# EAGLE design EL_Inverter1 (EAGLE 7.2.0)
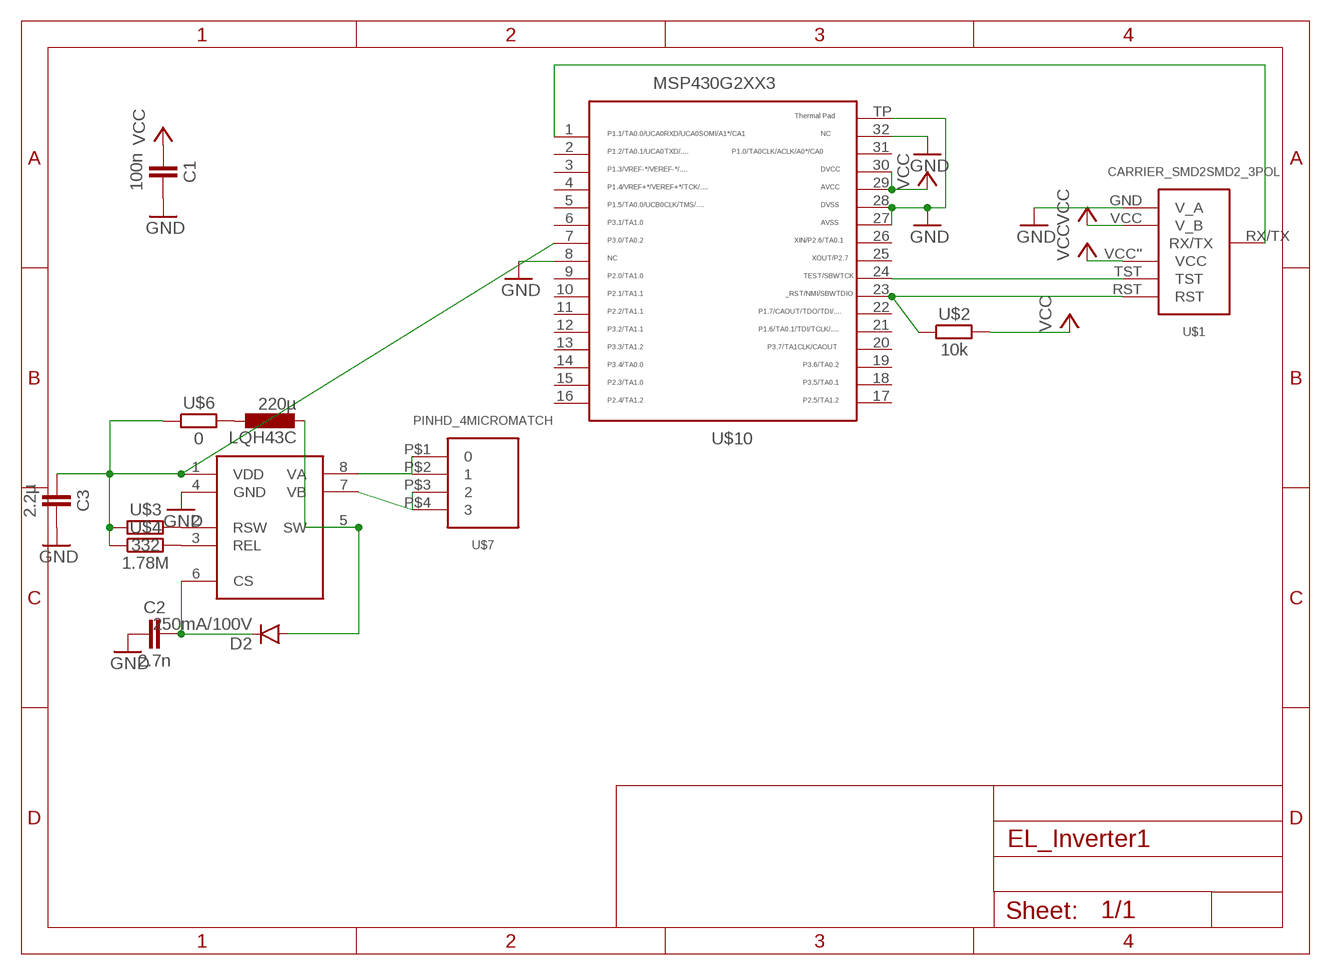
[diagram p0: schematic, sheet 1]

## Parts
C1  100n  CAPACITOR  [603]
C2  2.7n  CAPACITOR  [603]
C3  2.2µ  CAPACITOR  [603]
D2  250mA/100V  DIODEBAS16  [SOD-323]
LQH43C  220µ  L-EUL1812  [L1812]
U$1  CARRIER_SMD2SMD2_3POL  [CARRIER_SMD2_3POL]
U$2  10k  RESISTOR0603  [603]
U$3  332  RESISTOR0603  [603]
U$4  1.78M  RESISTOR0603  [603]
U$6  0  RESISTOR0603  [603]
U$7  PINHD_4MICROMATCH  [MICROMATCH4P0L]
U$8  MIC4830  [MSOP8]
U$10  MSP430G2553  [QFN32]

## Nets
GND: C1.2 C2.1 C3.2 U$1.GND(V_A) U$8.4(GND) U$10.8 U$10.27 U$10.28 U$10.32 U$10.TP
N$2: U$3.2 U$8.2(RSW)
N$3: U$1.TST U$10.24
N$4: U$1.RST U$2.1 U$10.23
N$5: U$4.2 U$8.3(REL)
N$6: C2.2 D2.C U$8.6(CS)
N$7: D2.A LQH43C.2 U$8.5(SW)
N$11: LQH43C.1 U$6.2
N$12: U$1.RX/TX U$10.1
N$13: C3.1 U$3.1 U$4.1 U$6.1 U$8.1(VDD) U$10.7
N$14: U$7.P$1 U$7.P$2 U$8.8(VA)
N$16: U$7.P$3 U$7.P$4 U$8.7(VB)
VCC: C1.1 U$1.VCC''(VCC) U$1.VCC(V_B) U$2.2 U$10.29 U$10.30
Unconnected: U$10.2 U$10.3 U$10.4 U$10.5 U$10.6 U$10.9 U$10.10 U$10.11 U$10.12 U$10.13 U$10.14 U$10.15 U$10.16 U$10.17 U$10.18 U$10.19 U$10.20 U$10.21 U$10.22 U$10.25 U$10.26 U$10.31

## Library data of the parts
C1-C3 = thar:CAPACITOR
D2 = SparkFun-DiscreteSemi:DIODE: Diode These are standard reverse protection diodes and small signal diodes. SMA package can handle up to about 1A. SOD-323 can handle about 200mA. What the SOD-323 package when ordering, there are some mfgs out there that are 5-pin packages.; PROD_ID: DIO-09646
LQH43C = rcl:L-EU: INDUCTOR, European symbol
U$1 = thar:CARRIER_SMD2
U$2-U$4 U$6 = thar:RESISTOR
U$7 = thar:PINHD_4
U$8 = thar:MIC4830: MICREL SEMICONDUCTOR - MIC4830YMM - EL TREIBER,LN, 180VP-P, 8MSOP Farnell Best.Nr.: 1663113 Herst.Bez.: MIC4830YMM
U$10 = thar:MSP430G2553: TEXAS INSTRUMENTS MSP430G2553IRHB32R MCU, 16BIT, MSP430, 16MHZ, QFN-32 Farnell Best.Nr.: 2325726 Herst.Bez.: MSP430G2553IRHB32R

## Board
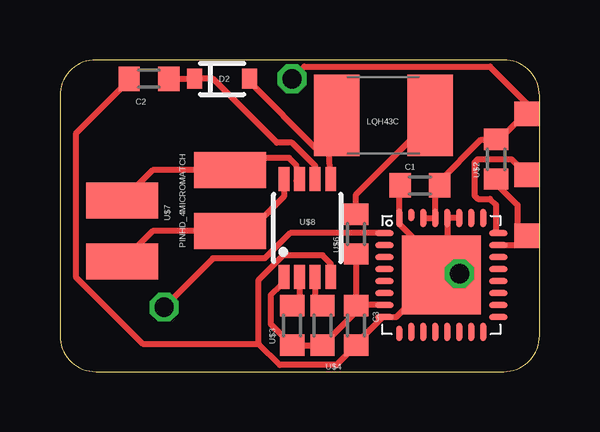
[diagram p1: board, top side]
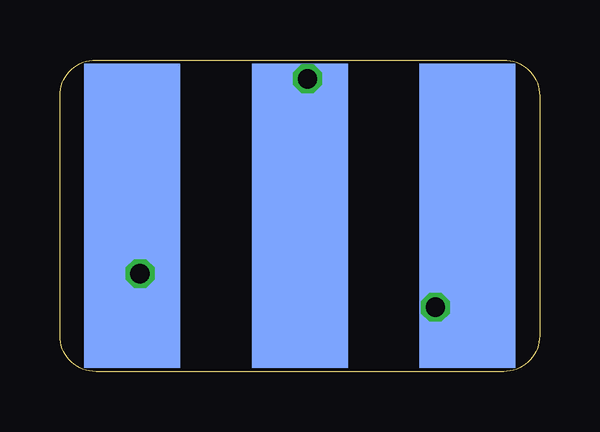
[diagram p2: board, bottom side, seen from below]

Size 20 x 13 mm. Coordinates in mm from the lower left corner, seen from the top.
Copper layers (1*16): Top 0.035mm / dielectric 1.5mm / Bottom 0.035mm
Design rules "Bilex DRU *": minimum track width 10mil, minimum drill 24mil, track to track 10mil, track to pad 10mil, pad to pad 10mil, via to via 10mil, smd to smd 10mil, copper to edge 1mil, drill to drill 8mil, minimum pad ring 10mil, minimum via ring 8mil, stop-mask expansion 4mil, vias tented up to drill 0mil, thermal gap 10mil

### Footprints (pad centres in the part's own frame; a part is rotated, then mirrored left to right if it is on the bottom)
603 = smd 0.889 x 1.016: 1 -0.826,0; 2 0.826,0
SOD-323 = smd 0.63 x 0.83: A 1.15,0; C -1.15,0
L1812 = smd 1.9 x 3.4: 1 -1.95,0; 2 1.95,0
CARRIER_SMD2_3POL = smd 4 x 12.7 bottom: GND -6.985,0; RX/TX 6.985,0; VCC 0,0 | smd 1.016 x 1.016: RST -9.461,0.826; TST -9.461,-1.714; VCC'' -9.461,-4.255
MICROMATCH4P0L = smd 1.5 x 3: P$1 -1.905,2.25; P$2 -0.635,-2.25; P$3 0.635,2.25; P$4 1.905,-2.25
MSOP8 = smd 0.45 x 1: 1 -0.975,-2.05; 2 -0.325,-2.05; 3 0.325,-2.05; 4 0.975,-2.05; 5 0.975,2.05; 6 0.325,2.05; 7 -0.325,2.05; 8 -0.975,2.05
QFN32 = smd 0.762 x 0.254: 1 -2.375,1.75; 2 -2.375,1.25; 3 -2.375,0.75; 4 -2.375,0.25; 5 -2.375,-0.25; 6 -2.375,-0.75; 7 -2.375,-1.25; 8 -2.375,-1.75; 17 2.375,-1.75; 18 2.375,-1.25; 19 2.375,-0.75; 20 2.375,-0.25; 21 2.375,0.25; 22 2.375,0.75; 23 2.375,1.25; 24 2.375,1.75 | smd 0.254 x 0.635: 9 -1.75,-2.438 | smd 0.254 x 0.762: 10 -1.25,-2.375; 11 -0.75,-2.375; 12 -0.25,-2.375; 13 0.25,-2.375; 14 0.75,-2.375; 15 1.25,-2.375; 16 1.75,-2.375; 25 1.75,2.375; 26 1.25,2.375; 27 0.75,2.375; 28 0.25,2.375; 29 -0.25,2.375; 30 -0.75,2.375; 32 -1.75,2.375 | smd 0.254 x 0.508: 31 -1.25,2.5 | smd 3.302 x 3.302: TP 0,0

### Placement (x,y rotation side)
C1  15.01,7.77 180 top
C2  3.71,12.21 0 top
C3  12.35,1.92 270 top
D2  6.76,12.21 0 top
LQH43C  13.49,10.69 180 top
U$1  10,6.5 180 top
U$2  18.19,8.86 90 top
U$3  9.68,1.92 90 top
U$4  10.95,1.92 90 top
U$6  12.35,5.74 90 top
U$7  4.85,6.5 90 top
U$8  10.31,5.99 0 top
U$10  15.9,4.03 0 top

### Tracks (layer width: path | path; a pad name or v marks a point on that pad's centre or on a via)
GND  (via drill 0.8)
  Top 0.254: U$10.27 U$10.28 16.15,4.72 | 16.37,4.58 16.19,5.38 16.16,5.35 | 16.37,4.58 16.43,4.35 | 16.43,4.35 16.48,3.06 U$10.TP 15.01,2.94 14.89,3.14 14.03,2.28 U$10.8 13.46,2.28 12.47,1.29 12.28,1.29 C3.2 11.52,0.27 9.17,0.27 8.28,1.16 | 16.15,4.72 16.15,4.42 16.43,4.35 | 16.15,4.72 15.52,5.35 14.76,5.55 14.15,6.16 U$10.32 14.15,7.73 C1.2 | U$8.4 11.29,4.51 10.95,4.85 9.3,4.85 8.28,3.83 8.28,1.16 | C2.1 2.89,12.15 0.66,9.93 0.66,3.96 3.46,1.16 8.28,1.16 | v16.66,4.08 16.66,4.29 16.37,4.58
  Bottom 0.254: 18,6.5 17.93,6.57 v16.66,4.08 16.98,10.25 U$1.GND
N$2
  Top 0.254: U$8.2 9.99,2.93 U$3.2
N$3
  Top 0.254: 19.61,7.88 19.46,8.02 19.5,8.18 | U$10.24 18.19,5.78 18.19,6.95 17.93,7.21 17.43,7.21 17.3,7.33 17.3,8.73 17.43,8.86 18.82,8.86 19.5,8.18 | 19.5,8.18 U$1.TST
N$4
  Top 0.254: 19.46,5.48 19.5,5.38 | 19.46,5.48 19.5,5.69 19.08,5.74 19.08,6.95 18.06,7.97 U$2.1 | U$10.23 19.28,5.28 19.46,5.48 | U$1.RST 19.46,5.48
N$5
  Top 0.254: U$8.3 10.64,2.93 U$4.2
N$6
  Top 0.254: C2.2 D2.C 6.38,12.21 9.04,9.54 9.68,9.54 10.64,8.59 U$8.6 10.64,7.95
N$7
  Top 0.254: U$8.5 11.16,10.52 11.2,10.56 11.16,10.43 LQH43C.2 11.46,10.35 10.7,9.29 7.9,12.09 D2.A
N$11
  Top 0.254: U$6.2 12.35,7.39 14.76,9.8 14.76,10.48 LQH43C.1
N$12  (via drill 0.8)
  Top 0.254: U$10.1 9.6,5.78 8.54,4.72 6.38,4.72 v4.35,2.69
  Bottom 0.254: U$1.RX/TX 3.01,4.65 v4.35,2.69
N$13
  Top 0.254: U$10.7 12.44,2.78 C3.1 | U$6.1 12.16,4.91 12.35,4.85 C3.1 | U$8.1 9.21,3.62 8.79,3.2 8.79,1.99 U$3.1 U$4.1 12.22,2.37 12.22,2.75 C3.1
N$14
  Top 0.254: U$8.8 9.34,7.3 8.28,6.24 7.48,6.24 U$7.P$2 3.87,5.86 U$7.P$1
N$16
  Top 0.254: 9.86,7.96 U$8.7 9.86,8.6 9.55,8.91 8.28,8.91 8.28,8.78 7.48,8.78 U$7.P$4 | 7.23,8.53 U$7.P$4 | U$7.P$4 3.87,8.4 U$7.P$3
VCC  (via drill 0.8)
  Top 0.254: 19.5,10.52 19.46,10.56 | 19.46,10.56 19.2,10.51 19.2,10.56 18.12,9.48 U$2.2 17.55,9.67 15.78,7.89 15.78,7.77 | 19.5,11.11 19.65,10.95 19.65,10.75 19.46,10.56 | U$1.VCC'' 19.46,11.07 19.5,11.11 | 19.5,11.11 19.5,11.16 17.93,12.72 10.19,12.72 v9.68,12.21 | U$10.30 U$10.29 15.65,7.52 15.78,7.77 | C1.1 15.78,7.77
  Bottom 0.254: 10,10.88 v9.68,12.21 10,11.26 U$1.VCC